# EasyEDA Pro project SCH_and_PCB.epro, board PCB5
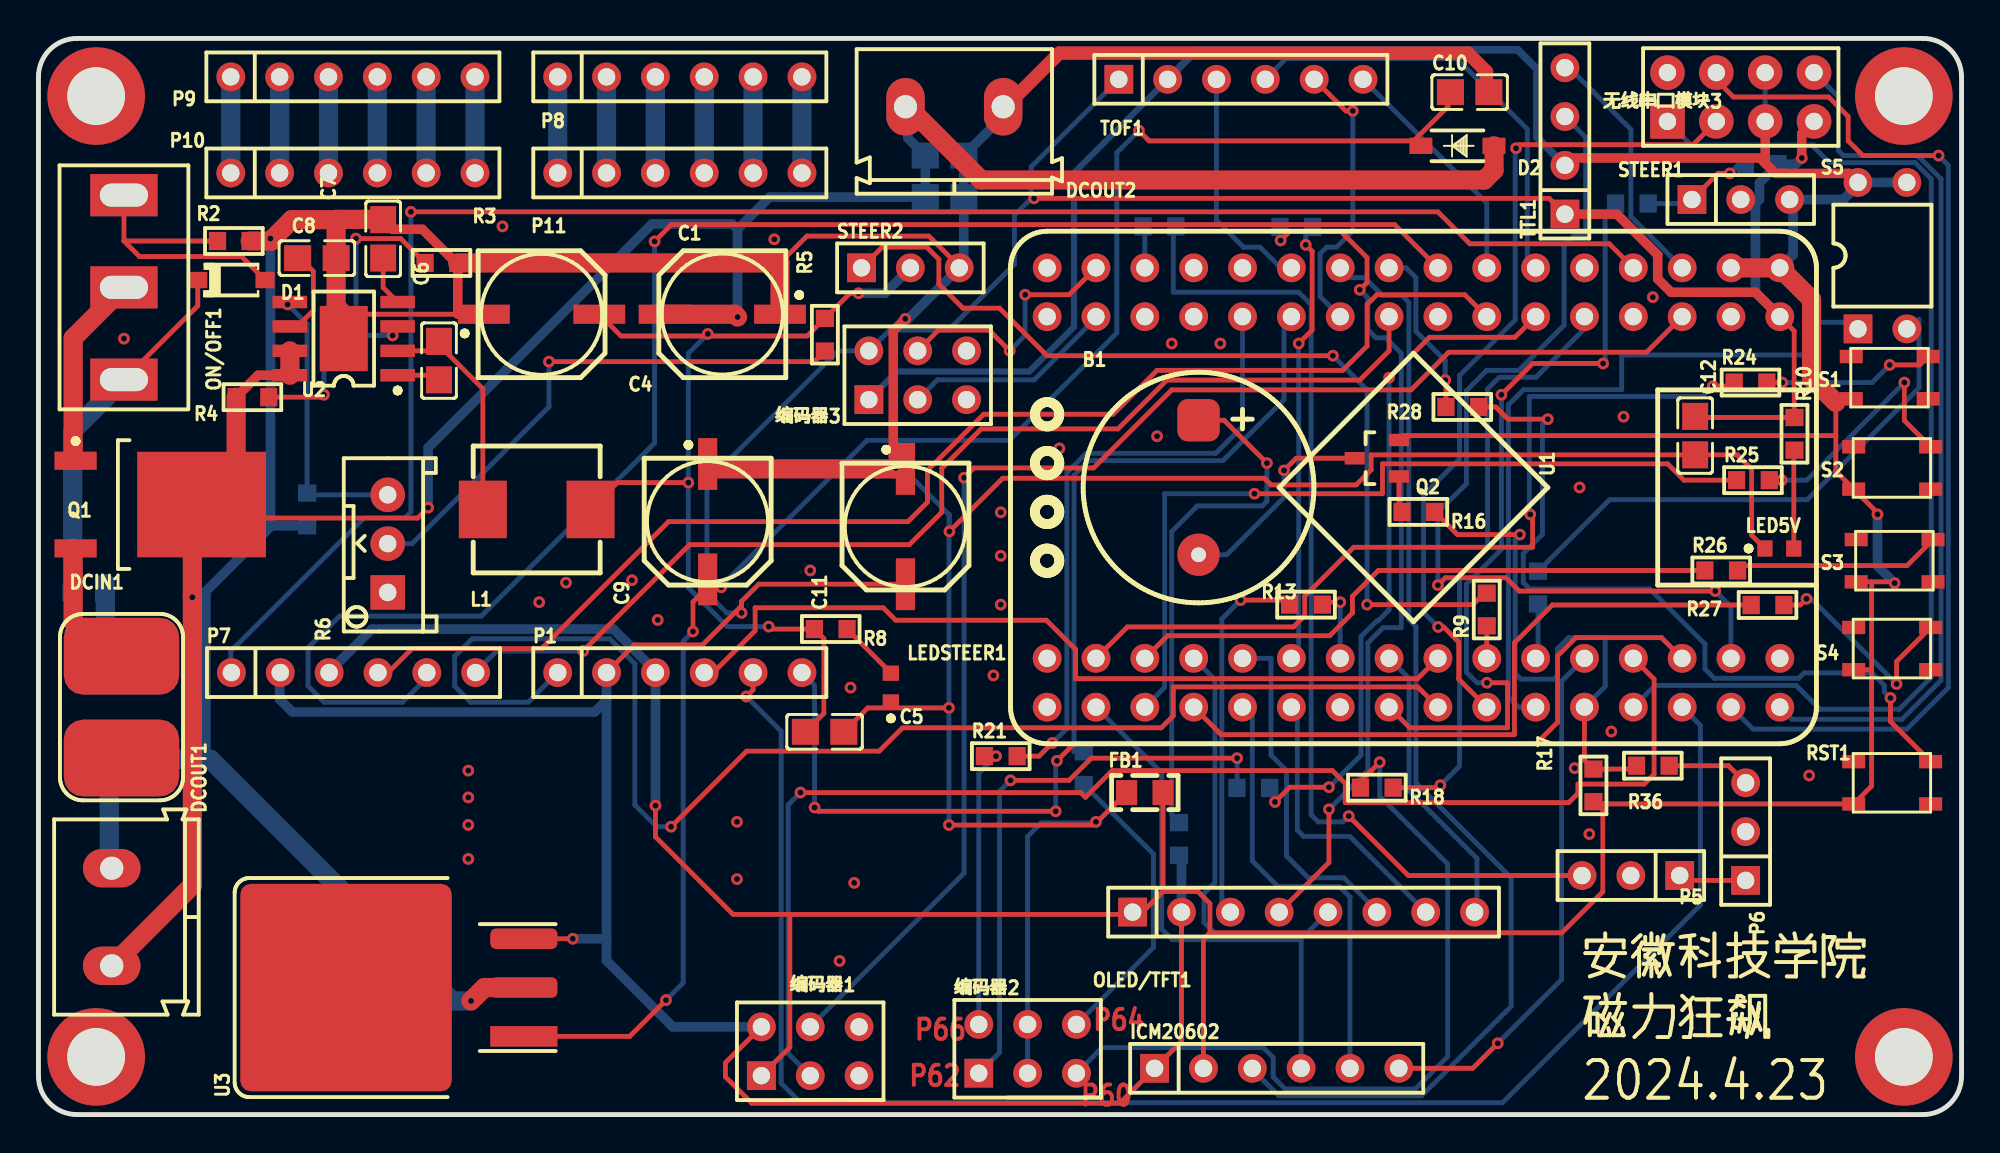
[diagram p8: board, top side]
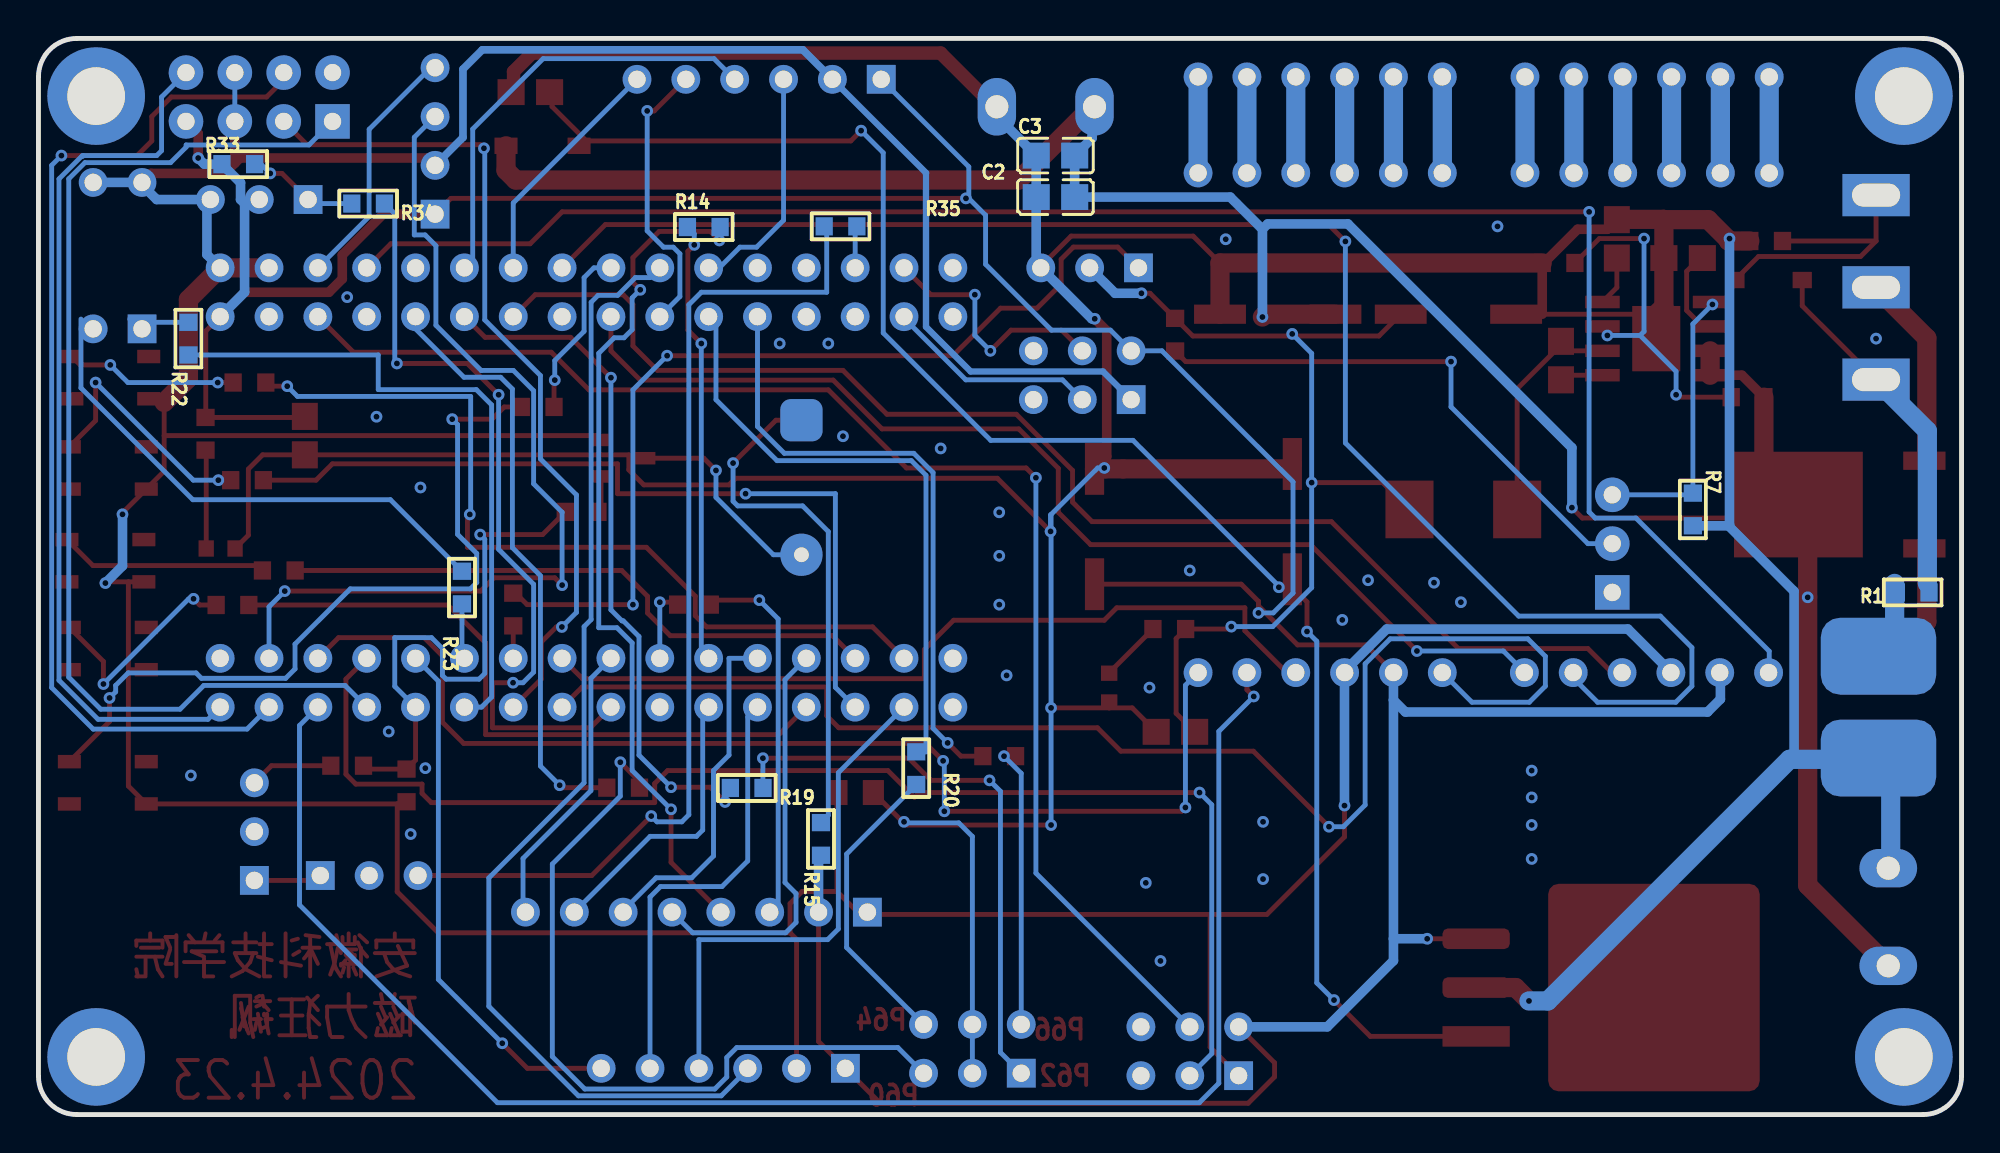
[diagram p9: board, bottom side, seen from below]

Outline 100 x 56 mm; copper layers: Top Layer, Bottom Layer. Coordinates in mm from the lower left corner of the outline.
Outline path: 0,54 0,2 arc(0.59,0.59) 2,0 98,0 arc(99.41,0.59) 100,2 100,54 arc(99.41,55.41) 98,56 2,56 arc(0.59,55.41) 0,54
Stack: Top Layer 0.035mm / Dielectric1 1.51mm FR4 er 4.5 / Bottom Layer 0.035mm

## Design rules (mm)
template: JLCPCB Capability(Two Layers Board)
spacing copperThickness1oz (default): track to track 0.102, other pairs 0.152 to 0.3
spacing copperThickness2oz: track to track 0.203, other pairs 0.152 to 0.3
track width copperThickness1oz (default): min 0.127, default 0.254, max 2.54
track width copperThickness2oz: min 0.203, default 0.254, max 2.54
differential pair differentialPair (default): width min 0.127, default 0.254, max 2.54; gap min 0.152, default 0.152
via viaSize (default): diameter min 0.5, default 0.61, max 10; hole min 0.3, default 0.305, max 6.3

## Placement (name value [footprint] x y rotation side)
B1  BEEP  [蜂鸣器-直插-无源蜂鸣器]  60.32 32.63 0 top
C1  100uF  [CAPS6.3]  35.56 41.65 0 top
C2  10uF  [C0805]  47.12 47.75 180 bottom
C3  100nF  [C0805]  47.12 49.9 180 bottom
C4  220uF  [CAPS6.3]  26.16 41.65 180 top
C5  100nF  [C0805]  40.88 19.92 180 top
C6  100nF  [C0805]  20.83 39.24 270 top
C7  100nF  [C0805]  17.92 45.57 270 top
C8  1uF  [C0805]  14.48 44.57 0 top
C9  100uF  [CAPS6.3]  34.8 30.85 90 top
C10  100nF  [C0805]  74.42 53.21 0 top
C11  220uF  [CAPS6.3]  45.09 30.6 90 top
C12  100nF  [C0805]  86.15 35.33 270 top
D1  BZT52C16  [SOD-123-L]  10.03 43.43 180 top
D2  SS54  [SOD-123]  73.79 50.41 180 top
DCIN1  T型插头  [WIRED T-HEADER THROUGHHOLE]  4.32 21.2 0 top
DCOUT1  DCOUT1  [KF/WJ/DG 301-2P-5.0MM]  3.81 10.28 270 top
DCOUT2  DCOUT2  [KF/WJ/DG 301-2P-5.0MM]  47.62 52.44 180 top
FB1  0R  [INDC2012[0805]S]  57.53 16.76 0 top
ICM20602  Header 6  [HDR1X6]  58.04 2.41 0 top
L1  3.3uH  [0630 TPC 7*7*3]  25.91 31.49 180 top
LED5V  GREEN  [LEDC1608(0603)]  90.53 29.46 0 top
LEDSTEER1  GREEN  [LEDC1608(0603)]  44.32 22.22 90 top
NOREF  -  [Pad_e85]  3 53 0 top
NOREF#2  -  [Pad_e86]  97 53 0 top
NOREF#3  -  [Pad_e84]  3 3 0 top
NOREF#4  -  [Pad_e87]  97 3 0 top
OLED/TFT1  Header 8  [HDR1X8]  56.9 10.53 0 top
ON/OFF1  SW-SPDT  [SS12D10]  4.44 43.05 90 top
P1  Header-D-M 1x6P  [HDR1X6-M]  27 23 0 top
P5  pwm1  [HDR1X3]  85.34 12.44 180 top
P6  pwm2  [HDR1X3]  88.77 12.19 90 top
P7  Header-D-M 1x6P  [HDR1X6-M]  10.03 23 0 top
P8  Header-D-M 1x6P  [HDR1X6-M]  27 54 0 top
P9  Header-D-M 1x6P  [HDR1X6-M]  10 54 0 top
P10  Header-D-M 1x6P  [HDR1X6-M]  10 49 0 top
P11  Header-D-M 1x6P  [HDR1X6-M]  27 49 0 top
Q1  HY19P03  [TO-252AA]  5.21 31.74 0 top
Q2  S8050  [SOT-23]  69.6 34.16 180 top
R1  4.7K  [RESC1608[0603]S-N]  2.54 27.17 180 bottom
R2  1K  [RESC1608[0603]S-N]  10.16 45.46 180 top
R3  10K  [RESC1608[0603]S-N]  20.95 44.32 180 top
R4  10K  [RESC1608[0603]S-N]  11.13 37.33 0 top
R5  100K  [RESC1608[0603]S-N]  40.89 40.58 270 top
R6  100K  [RESPOT3296]  18.16 27.17 90 top
R7  15K  [RESC1608[0603]S-N]  13.97 31.49 90 bottom
R8  10K  [RESC1608[0603]S-N]  41.2 25.27 180 top
R9  1K  [RESC1608[0603]S-N]  75.31 26.28 90 top
R10  4.7K  [RESC1608[0603]S-N]  91.31 35.43 270 top
R13  100R  [RESC1608[0603]S-N]  65.91 26.54 180 top
R14  100R  [RESC1608[0603]S-N]  65.4 46.19 180 bottom
R15  10R  [RESC1608[0603]S-N]  59.31 14.34 90 bottom
R16  4.7K  [RESC1608[0603]S-N]  71.75 31.36 180 top
R17  10K  [RESC1608[0603]S-N]  80.86 17.13 270 top
R18  100R  [RESC1608[0603]S-N]  69.6 17.01 180 top
R19  100R  [RESC1608[0603]S-N]  63.17 17 0 bottom
R20  100R  [RESC1608[0603]S-N]  54.36 18.03 270 bottom
R21  100R  [RESC1608[0603]S-N]  50.04 18.65 0 top
R22  470R  [RESC1608[0603]S-N]  92.2 40.38 90 bottom
R23  470R  [RESC1608[0603]S-N]  77.98 27.42 90 bottom
R24  470R  [RESC1608[0603]S-N]  89.03 38.09 0 top
R25  470R  [RESC1608[0603]S-N]  89.15 33.01 0 top
R26  470R  [RESC1608[0603]S-N]  87.5 28.31 0 top
R27  470R  [RESC1608[0603]S-N]  89.91 26.52 0 top
R28  470R  [RESC1608[0603]S-N]  74.04 36.82 0 top
R33  10K  [RESC1608[0603]S-N]  89.61 49.46 0 bottom
R34  100R  [RESC1608[0603]S-N]  82.86 47.41 0 bottom
R35  100R  [RESC1608[0603]S-N]  58.29 46.22 0 bottom
R36  100R  [RESC1608[0603]S-N]  83.95 18.15 0 top
RST1  Button  [PTS810-3*4-CURVEPIN]  96.39 17.27 0 top
S1  Button  [PTS810-3*4-CURVEPIN]  96.27 38.35 0 top
S2  Button  [PTS810-3*4-CURVEPIN]  96.39 33.65 0 top
S3  Button  [PTS810-3*4-CURVEPIN]  96.52 28.82 0 top
S4  Button  [PTS810-3*4-CURVEPIN]  96.39 24.25 0 top
S5  SW DIP-2  [DIP4]  95.88 44.7 0 top
STEER1  holl  [HDR1X3#2]  85.98 47.62 0 top
STEER2  Header 3  [HDR1X3#3]  42.8 44.06 0 top
TOF1  Header 6  [HDR1X6]  56.18 53.87 0 top
TTL1  Header 4  [HDR1X4]  79.38 46.86 90 top
U1  STC16F40K128_CoreBoard  [STC16F40K128_COREBOARD]  71.5 32.63 270 top
U2  SY8205FCC  [SOP-8E]  15.88 40.38 180 top
U3  SPX2940-5.0  [TO-263-3]  20.62 6.61 90 top
无线串口模块3  Header 4X2  [HDR4X2_A1]  84.71 51.68 0 top
编码器1  Header 3X2  [HDR2X3]  37.59 2.03 0 top
编码器2  电机信号  [HDR2X3]  48.9 2.15 0 top
编码器3  Header 3X2  [HDR2X3]  43.18 37.2 0 top

## Footprints (pads in the part's own frame, mm; a bottom-side part is the same pattern mirrored in y, then rotated)
0630 TPC 7*7*3
  rect 2.5x3 smd: 1(-2.8,0) 2(2.8,0)
C0805
  rect 1.41x1.35 smd: 1(-1,0) 2(1,0)
CAPS6.3
  rect 2.7x1 smd: 1(-3,0) 2(3,0)
DIP4
  rect 1.5x1.5 hole 0.9x0.905: 1(-1.27,-3.81)
  round 1.5 hole 0.9x0.905: 2(1.27,-3.81) 3(1.27,3.81) 4(-1.27,3.81)
HDR1X3
  rect 1.5x1.5 hole 0.905x0.9: 1(0,0)
  round 1.5 hole 0.9: 2(2.54,0)
  round 1.5 hole 0.905x0.9: 3(5.08,0)
HDR1X3#2
  rect 1.5x1.5 hole 0.905x0.9: 1(0,0)
  round 1.5 hole 0.905x0.9: 2(2.54,0) 3(5.08,0)
HDR1X3#3
  rect 1.5x1.5 hole 0.9: 1(0,0)
  round 1.5 hole 0.9: 2(2.54,0) 3(5.08,0)
HDR1X4
  rect 1.5x1.5 hole 0.905x0.9: 1(0,0)
  round 1.5 hole 0.905x0.9: 2(2.54,0) 3(5.08,0) 4(7.62,0)
HDR1X6
  rect 1.5x1.5 hole 0.905x0.9: 1(0,0)
  round 1.5 hole 0.905x0.9: 2(2.54,0) 3(5.08,0) 4(7.62,0) 5(10.16,0) 6(12.7,0)
HDR1X6-M
  round 1.5 hole 0.905x0.9: 1(0,0) 2(2.54,0) 3(5.08,0) 4(7.62,0) 5(10.16,0) 6(12.7,0)
HDR1X8
  rect 1.5x1.5 hole 0.905x0.9: 1(0,0)
  round 1.5 hole 0.905x0.9: 2(2.54,0) 3(5.08,0) 4(7.62,0) 5(10.16,0) 6(12.7,0) 7(15.24,0) 8(17.78,0)
HDR2X3
  rect 1.5x1.5 hole 0.9: 1(0,0)
  round 1.5 hole 0.9: 2(0,2.54) 3(2.54,0) 4(2.54,2.54) 5(5.08,0) 6(5.08,2.54)
HDR4X2_A1
  rect 1.8x1.8 hole 0.9: 1(0,0)
  round 1.8 hole 0.9: 2(0,2.54) 3(2.54,0) 4(2.54,2.54) 5(5.08,0) 6(5.08,2.54) 7(7.62,0)
  round 1.8 hole 0.905x0.9: 8(7.62,2.54)
INDC2012[0805]S
  rect 1.1x1.3 smd: 1(-0.948,0) 2(0.948,0)
KF/WJ/DG 301-2P-5.0MM
  oval 2x3 hole 1.2x1.205: 1(2.54,0) 2(-2.54,0)
LEDC1608(0603)
  rect 0.8x0.85 smd: A(0.75,0) C(-0.75,0)
Pad_e84
  round 5.08 hole 3: 1(0,0)
Pad_e85
  round 5.08 hole 3: 1(0,0)
Pad_e86
  round 5.08 hole 3: 1(0,0)
Pad_e87
  round 5.08 hole 3: 1(0,0)
PTS810-3*4-CURVEPIN
  rect 1.2x0.7 smd: 1(-2,-1.1) 2(2,1.1) 3(2,-1.1) 4(-2,1.1)
RESC1608[0603]S-N
  rect 0.9x0.95 smd: 1(-0.85,0) 2(0.85,0)
RESPOT3296
  rect 1.8x1.8 hole 0.905x0.9: 1(0,0)
  round 1.8 hole 0.9: 2(5.08,0) ADJ(2.54,0)
SOD-123
  rect 1.2x0.85 smd: A(-1.9,0) K(1.9,0)
SOD-123-L
  rect 1x0.85 smd: A(-1.75,0) K(1.75,0)
SOP-8E
  rect 2.5x3.4 smd: 0(0,0)
  rect 1.8x0.65 smd: 1(-2.8,1.905) 2(-2.8,0.635) 3(-2.8,-0.635) 4(-2.8,-1.905) 5(2.8,-1.905) 6(2.8,-0.635) 7(2.8,0.635) 8(2.8,1.905)
SOT-23
  rect 1.05x0.65 smd: 1(-1.15,0.95) 2(-1.15,-0.95) 3(1.15,0)
SS12D10
  rect 2.2x3.5 hole 1.2x2.5: 1(-4.8,0) 2(0,0) 3(4.8,0)
STC16F40K128_COREBOARD
  round 1.5 hole 0.9: 1(-11.43,19.05) 2(-8.89,19.05) 3(-11.43,16.51) 5(-11.43,13.97) 6(-8.89,13.97) 8(-8.89,11.43) 10(-8.89,8.89) 12(-8.89,6.35) 17(-11.43,-1.27) 19(-11.43,-3.81) 22(-8.89,-6.35) 24(-8.89,-8.89) 27(-11.43,-13.97) 29(-11.43,-16.51) 30(-8.89,-16.51) 35(8.89,-16.51) 36(11.43,-16.51) 37(8.89,-13.97) 38(11.43,-13.97) 39(8.89,-11.43) 40(11.43,-11.43) 41(8.89,-8.89) 42(11.43,-8.89) 43(8.89,-6.35) 44(11.43,-6.35) 45(8.89,-3.81) 47(8.89,-1.27) 48(11.43,-1.27) 49(8.89,1.27) 50(11.43,1.27) 51(8.89,3.81) 52(11.43,3.81) 53(8.89,6.35) 54(11.43,6.35) 55(8.89,8.89) 56(11.43,8.89) 57(8.89,11.43) 58(11.43,11.43) 59(8.89,13.97) 60(11.43,13.97) 61(8.89,16.51) 62(11.43,16.51)
  round 1.5 hole 0.905x0.9: 4(-8.89,16.51) 7(-11.43,11.43) 9(-11.43,8.89) 11(-11.43,6.35) 13(-11.43,3.81) 14(-8.89,3.81) 15(-11.43,1.27) 16(-8.89,1.27) 18(-8.89,-1.27) 20(-8.89,-3.81) 21(-11.43,-6.35) 23(-11.43,-8.89) 25(-11.43,-11.43) 26(-8.89,-11.43) 28(-8.89,-13.97) 31(-11.43,-19.05) 32(-8.89,-19.05) 33(8.89,-19.05) 34(11.43,-19.05) 46(11.43,-3.81) 63(8.89,19.05) 64(11.43,19.05)
TO-252AA
  rect 6.7x5.5 smd: 1(3.275,0)
  rect 2.2x0.95 smd: 2(-3.275,2.28) 3(-3.275,-2.28)
TO-263-3
  rect 1.07x3.5 smd: 1(-2.54,-4.623)
  custom 1.07x3.5 smd: 2(0,-4.623) 3(2.54,-4.623)
  custom 10.8x11 smd: 4(0,4.623)
WIRED T-HEADER THROUGHHOLE
  custom 6x4 hole 2.605x2.6: 1(0,2.65) 2(0,-2.65)
蜂鸣器-直插-无源蜂鸣器
  custom 2.2x2.2 hole 0.767x0.762: 1(0,3.5)
  round 2.2 hole 0.767x0.762: 2(0,-3.5)

## Nets
GND_5V: FB1.2 ICM20602.2 OLED/TFT1.1 P1.3 P7.3 Q2.2 R17.2 RST1.1 S1.1 S2.1 S3.1 S4.1 S5.3 S5.4 STEER1.3 TOF1.2 TTL1.2 U1.1 U1.3 无线串口模块3.5 无线串口模块3.6 编码器1.1 编码器3.1
GND_BAT: C1.2 C2.1 C3.1 C4.2 C5.1 C7.1 C8.2 C9.2 C10.2 C11.2 C12.2 DCIN1.2 DCOUT1.2 DCOUT2.2 FB1.1 LED5V.C LEDSTEER1.C R2.1 R3.1 R7.1 STEER2.3 U2.0 U3.2 编码器2.3 编码器2.4
GNDBAT: NOREF.1 NOREF#2.1 NOREF#3.1 NOREF#4.1 P5.1 P6.1
VCC_5V: C11.1 C12.1 ICM20602.1 OLED/TFT1.2 P1.2 P7.2 R10.1 R15.1 R33.2 STEER1.2 TOF1.1 TTL1.1 U1.2 U3.3 无线串口模块3.7 编码器1.2 编码器3.2
VCC_BAT: C1.1 C2.2 C3.2 D2.A DCOUT1.1 DCOUT2.1 Q1.1 R4.1 U2.7 U2.8
VCC_STEER: C4.1 C5.2 L1.1 R5.1 R8.2 STEER2.2
0.0: P1.1 U1.50
0.1: P1.4 U1.49
0.2: U1.52 无线串口模块3.3
0.3: U1.58 无线串口模块3.1
0.4: U1.57 编码器1.3
0.5: P1.5 U1.60
0.6: P1.6 U1.59
0.7: U1.62 无线串口模块3.4
1.0: TTL1.3 U1.61
1.1: TTL1.4 U1.5
1.3: P7.1 U1.7
1.4: P7.4 U1.14
1.6: P7.5 U1.15
1.7: P7.6 U1.18
2.0: OLED/TFT1.5 U1.39
2.1: OLED/TFT1.6 U1.41
2.2: OLED/TFT1.7 U1.44
2.3: R14.1 U1.43
2.5: R13.1 U1.45
2.6: R34.1 U1.48
2.7: OLED/TFT1.8 U1.47
3.3: R35.1 U1.27
3.4: U1.30 编码器3.3
3.5: U1.29 编码器3.4
4.0: ICM20602.3 U1.19
4.1: ICM20602.4 U1.36
4.2: ICM20602.5 U1.42
4.3: ICM20602.6 U1.55
4.4: TOF1.6 U1.13
4.5: U1.64 无线串口模块3.8
4.7: TOF1.5 U1.20
5.3: U1.6 编码器1.4
6.0: R18.1 U1.10
6.2: R19.2 U1.12
6.3: TOF1.4 U1.11
6.4: R20.1 U1.22
6.5: TOF1.3 U1.21
6.6: R21.2 U1.24
7.0: R24.1 U1.35
7.1: R25.1 U1.38
7.2: R26.1 U1.37
7.3: R27.1 U1.40
7.4: R9.1 U1.51
7.5: R22.1 U1.54
7.6: R23.1 U1.53
7.7: R16.1 R17.1 R36.1 U1.56
FB: R6.2 R7.2 U2.5
RST: R28.1 U1.17
$1N608: LEDSTEER1.A R8.1
$1N619: R5.2 R6.ADJ
$1N620: C6.1 L1.2 U2.2
$1N623: C7.2 U2.4
$1N624: R3.2 R4.2 U2.3
$1N625: C6.2 U2.1
$1N644: C8.1 U2.6
$1N667: R9.2 STEER2.1
$1N828: C9.1 C10.1 D2.K U3.1
$1N831: LED5V.A R10.2
$1N927: OLED/TFT1.3 R13.2
$1N930: OLED/TFT1.4 R14.2
$1N1033: B1.2 Q2.3
$1N1034: B1.1 R15.2
$1N1043: Q2.1 R16.2
$1N1188: R20.2 编码器2.6
$1N1189: R21.1 编码器2.2
$1N1190: R18.2 编码器2.5
$1N1191: R19.1 编码器2.1
$1N1401: DCIN1.1 Q1.3 R1.1
$1N1404: D1.K ON/OFF1.1 R1.2
$1N1405: D1.A ON/OFF1.3 R2.2
$1N1408: ON/OFF1.2 Q1.2
$1N1512: P5.3 R35.2
$1N1513: P6.3 R36.2
$1N1603: R33.1 R34.2 STEER1.1
$1N1624: R22.2 S5.1
$1N1625: R23.2 S5.2
$1N1628: R24.2 S1.2
$1N1629: R25.2 S2.2
$1N1630: R26.2 S3.2
$1N1631: R27.2 S4.2
$1N1632: R28.2 RST1.2
$1N8370: P9.1 P10.1
$1N8373: P9.2 P10.2
$1N8376: P9.3 P10.3
$1N8379: P9.4 P10.4
$1N8382: P9.5 P10.5
$1N8385: P9.6 P10.6
$1N8391: P8.1 P11.1
$1N8394: P8.2 P11.2
$1N8397: P8.3 P11.3
$1N8400: P8.4 P11.4
$1N8403: P8.5 P11.5
$1N8406: P8.6 P11.6

Pads without a net: P5 2; P6 2; R6 1; RST1 3 4; S1 3 4; S2 3 4; S3 3 4; S4 3 4; U1 4 8 9 16 23 25 26 28 31 32 33 34 46 63; U3 4; 无线串口模块3 2; 编码器1 5 6; 编码器3 5 6

## Via types
v1: diameter 0.61, hole 0.305, Top Layer to Bottom Layer, 120 vias

## Routing (per net, layer and track width the routed paths; a pad name or vN(x,y) marks a point on that pad's centre or on a via; arc(x,y) is an arc through that point)
GND_5V: length 265.1
  Top Layer w0.254: 58.48,11.61 60.29,11.61 60.92,10.98 60.92,9.46 ; 58.48,11.61 57.4,10.53 OLED/TFT1.1 56.78,10.42 39.07,10.42 ; 58.48,11.61 FB1.2 ; 95.32,27.72 95.32,23.15 ; 95.32,27.72 96.46,27.72 v1(96.52,27.66) ; 95.32,27.72 S3.1 ; 95.32,23.15 S4.1 ; 95.32,23.15 95.32,17.1 RST1.1 81.34,16.17 ; v1(95.63,31.23) 95.63,31.31 S2.1 93.46,33.48 93.46,35.33 ; 81.34,16.17 80.97,16.17 R17.2 ; 81.34,16.17 81.34,11.59 79.21,9.46 60.92,9.46 ; 60.92,9.46 60.58,9.12 60.58,2.41 ; 93.46,35.33 70.97,35.33 Q2.2 ; 93.46,35.33 93.46,37.06 93.65,37.25 S1.1 ; 39.07,10.42 39.07,3.51 编码器1.1 ; 39.07,10.42 36.12,10.42 32.09,14.45 v1(32.09,16.08)
  Top Layer w0.5: 94.62,48.51 94.15,48.98 90.32,48.98 89.79,49.51 ; 89.79,51.68 89.79,49.51 ; 89.79,49.51 89.52,49.78 79.76,49.78 TTL1.2
  Top Layer w1: 93.46,37.06 92.2,38.32 92.2,42.41 U1.1 U1.3
  Bottom Layer w0.254: 91.24,47.62 STEER1.3 ; 89.79,54.22 89.79,51.68
  Bottom Layer w0.33: TOF1.2 53.85,49 53.85,40.99 51.53,38.67 44.64,38.67 编码器3.1
  Bottom Layer w0.4: TOF1.2 60.25,55.41 76.92,55.41 77.93,54.4 77.93,50.85 TTL1.2
  Bottom Layer w0.5: 15.08,23 17.35,25.27 29.89,25.27 32.08,23.07 P1.3 32.09,22.99 v1(32.09,16.08) ; U1.1 91.24,44.75 91.24,47.62 93.85,47.62 94.74,48.51 97.28,48.51 ; v1(96.52,27.66) 95.63,28.55 v1(95.63,31.23)
GND_BAT: length 284.4
  Top Layer w0.254: 44.32,21.16 43.12,21.16 C5.1 ; 44.32,21.16 LEDSTEER1.C ; 44.32,21.16 v1(47.34,21.16) ; U2.0 15.88,41.65 C4.2 ; FB1.1 55.06,15.23 v1(54.99,15.23) 54.82,15.07 v1(47.34,15.07) ; STEER2.3 47.88,44.14 46.3,45.71 39.96,45.71 38.56,44.32 ; LED5V.C 89.09,30.15 89.09,33.59 88.34,34.33 C12.2 69.3,34.33 69.3,33.55 68.52,32.77 64.1,32.77 63.75,33.11 50.14,33.11 v1(47.37,30.35) ; 43.6,33.6 43.65,33.65 v1(44.58,33.65) 44.53,33.6 ; 12.12,45.46 12.06,45.51 v1(12.06,45.59)
  Top Layer w0.5: v1(45.07,41.41) 44.45,40.79 44.45,34.23 C11.2 ; 21.81,41.65 21.81,44.23 19.96,46.07 18.42,46.07 C7.1
  Top Layer w0.7: C10.2 75.29,53.33 75.29,54.27 74.33,55.24 53.09,55.24 50.29,52.44
  Top Layer w1: R2.1 12.12,45.46 12.12,45.51 13.18,46.57 15.48,46.57 ; 15.48,46.57 15.49,46.59 17.94,46.59 C7.1 ; 15.48,46.57 C8.2 15.48,42.05 15.88,41.65 ; R3.1 38.56,44.32 C1.2 ; 25.24,6.61 23.19,6.61 v1(22.49,5.91) ; C11.2 35.05,33.6 C9.2
  Bottom Layer w0.254: 47.34,31.22 47.37,31.2 v1(47.37,30.35) ; 47.34,31.22 44.92,33.65 v1(44.58,33.65) ; 47.34,31.22 v1(47.34,21.16) v1(47.34,15.07) ; v1(54.99,15.23) 54.94,15.18 52.14,15.18 51.44,14.47 编码器2.4 编码器2.3 ; 3.68,18.49 3.67,18.49
  Bottom Layer w0.5: 12.12,30.64 12.06,30.69 v1(12.06,45.59) ; 12.12,30.64 R7.1 ; 12.12,30.64 8.71,27.23 8.71,18.72 8.94,18.49 ; 50.29,52.44 50.29,52.08 C3.1 C2.1 48.12,44.3 STEER2.3 45.23,41.41 v1(45.07,41.41)
  Bottom Layer w1: v1(22.49,5.91) 21.51,5.91 8.94,18.49 3.68,18.49 3.68,13.2
GNDBAT: length 3.5
  Top Layer w0.254: P6.1 85.6,12.19 P5.1
  vias: v1(4.44,40.38) v1(22.35,17.9) v1(22.35,16.5) v1(22.35,15.07) v1(22.35,13.3) v1(24.13,46.22) v1(26.03,26.66) v1(27.43,27.68) v1(30.86,27.81) v1(32.2,25.74) v1(36.32,15.23) v1(36.32,12.25) v1(38.26,45.55) v1(40.13,28.31) v1(41.66,7.99) v1(42.23,22.22) v1(42.42,12.06) v1(49.66,22.85) v1(50.04,31.34) v1(50.04,29.08) v1(50.04,26.54) v1(53.09,34.66) v1(58.17,35.3) v1(58.93,40.12) v1(61.46,40.12) v1(79.88,18.03) v1(80.14,32.63) v1(80.65,14.6) v1(81.79,19.93) v1(82.42,36.31) v1(83.95,42.54) v1(92.07,17.65)
VCC_5V: length 211.6
  Top Layer w0.254: 36.56,26.7 36.56,26.47 34.53,24.44 30.98,24.44 P1.2 ; 36.56,26.7 37.46,27.6 C11.1 ; 36.56,26.7 36.56,26.7 v1(36.56,26.11) ; 编码器1.2 35.72,2.7 35.72,1.96 37.1,0.59 56.22,0.59 ICM20602.1 59.44,3.8 OLED/TFT1.2 ; 91.3,36.28 86.2,36.28 C12.1 ; 91.3,36.28 R10.1 ; 91.3,36.28 91.3,40.77 U1.2 ; v1(27.79,9.15) 25.24,9.15 ; TTL1.1 78.55,47.68 v1(51.77,47.68)
  Top Layer w0.5: TTL1.1 82.08,46.86 84.2,44.73 84.2,43.49 84.9,42.79 89.28,42.79 U1.2 ; v1(91.69,49.78) 91.69,51.05 无线串口模块3.7
  Bottom Layer w0.254: 51.62,47.68 51.62,49.32 TOF1.1 ; 51.62,47.68 v1(51.77,47.68) ; 51.62,47.68 50.75,46.8 50.75,44.25 47.32,40.82 44.26,40.82 编码器3.2 41.58,39.74 34.76,32.92 34.76,27.14 35.79,26.11 v1(36.56,26.11) ; 89.49,47.62 STEER1.2
  Bottom Layer w0.5: 29.54,21.57 29.54,9.15 ; 29.54,21.57 P1.2 ; 29.54,21.57 28.92,20.95 13.21,20.95 12.54,21.62 12.54,23 ; 29.54,9.15 29.54,8.01 32.98,4.56 编码器1.2 ; 29.54,9.15 v1(27.79,9.15) ; R15.1 59.44,13.37 OLED/TFT1.2 ; U1.2 89.28,42.79 89.28,47.41 89.49,47.62 89.49,48.49 R33.2 91.38,49.46 v1(91.69,49.78)
VCC_BAT: length 130.1
  Top Layer w0.254: v1(20.26,31.58) 19.72,31.04 10.98,31.04 10.28,31.74
  Top Layer w0.5: U2.8 11.42,38.47 10.28,37.33
  Top Layer w1: v1(36.35,41.5) 36.21,41.65 C1.1 ; 45.21,52.44 49.02,48.63 75.18,48.63 75.69,49.14 D2.A ; 10.28,37.33 10.28,31.74 8.36,31.74 8,31.39 v1(8,26.92) 8,11.93 DCOUT1.1 ; U2.7 U2.8
  Bottom Layer w0.5: 36.35,46.07 v1(36.35,41.5) ; 36.35,46.07 38.03,47.75 C2.2 C3.2 45.21,50.81 45.21,52.44 ; 36.35,46.07 36.08,46.35 31.91,46.35 20.26,34.7 v1(20.26,31.58)
VCC_STEER: length 50.9
  Top Layer w0.254: C4.1 30.3,40.52 34.81,40.52 ; v1(33.79,32.89) 30.11,32.89 L1.1 ; v1(42.65,42.74) 42.2,42.74 R5.1 39.97,40.52 34.81,40.52 ; v1(34.81,40.62) 34.81,40.52 ; v1(37.97,25.39) 38.1,25.27 R8.2 40.84,24.77 40.84,20.88 C5.2
  Bottom Layer w0.254: v1(37.97,25.39) 35.82,25.39 33.79,27.42 v1(33.79,32.89) 33.79,39.61 v1(34.81,40.62)
  Bottom Layer w0.5: v1(42.65,42.74) 44.02,42.74 STEER2.2
0.0: length 72.1
  Top Layer w0.254: U1.50 71.72,22.25 59.01,22.25 59.01,20.76 58.38,20.13 44.93,20.13 43.72,18.91 36.82,18.91 v1(32.89,14.98)
  Bottom Layer w0.254: P1.1 25.46,21.46 22.48,21.46 21.64,22.29 21.64,23.85 22.55,24.76 29.71,24.76 31.01,23.45 31.01,16.11 32.14,14.98 v1(32.89,14.98)
0.1: length 43.1
  Top Layer w0.254: P1.4 35.09,23 37.27,25.18 37.27,26.37 43.93,26.37 44.58,25.72 52.41,25.72 53.93,24.2 53.93,22.68 71.71,22.68 U1.49
0.2: length 43.6
  Top Layer w0.254: v1(76.84,50.28) 77.02,50.47 86.04,50.47 无线串口模块3.3 ; v1(72.78,25.37) 73.07,25.37 73.85,24.59 73.85,22.66 U1.52
  Bottom Layer w0.254: v1(76.84,50.28) 76.79,50.24 76.79,41.35 73.9,38.46 73.9,34.12 72.02,32.25 72.02,26.13 v1(72.78,25.37)
0.3: length 58.1
  Bottom Layer w0.254: U1.58 84.06,22.33 91.4,22.33 92.64,21.09 96.76,21.09 98.43,22.76 98.43,48.69 97.58,49.54 93.13,49.54 92.32,50.35 92.32,50.46 85.93,50.46 无线串口模块3.1
0.4: length 69.2
  Top Layer w0.254: v1(39.62,16.76) 54.2,16.76 54.45,16.51 55.83,17.9 67.28,17.9 67.96,17.23 67.96,16.23 79.57,16.23 80.05,16.72 80.05,17.2 83.5,17.2 84.01,17.71 84.01,22.66 U1.57
  Bottom Layer w0.254: 编码器1.3 38.99,3.17 38.99,16.12 v1(39.62,16.76)
0.5: length 85.4
  Top Layer w0.254: v1(36.81,21.76) 37.16,22.11 P1.5
  Bottom Layer w0.254: U1.60 86.43,20.25 86.43,10.91 76.13,0.62 39.63,0.62 38.62,1.63 38.62,19.94 v1(36.81,21.76)
0.6: length 60.2
  Top Layer w0.254: v1(52.96,18.41) 53.86,19.31 77.89,19.31 78.99,20.42 78.99,23.87 79.94,24.82 84.4,24.82 U1.59 ; v1(52.9,15.78) 40.56,15.78 v1(40.36,15.98)
  Bottom Layer w0.254: v1(52.96,18.41) 52.9,18.34 v1(52.9,15.78) ; P1.6 40.36,22.34 v1(40.36,15.98)
0.7: length 54.9
  Top Layer w0.254: v1(98.81,49.9) 94.87,49.9 94.11,50.67 94.11,51.94 93.09,52.95 88.14,52.95 87.25,53.84 无线串口模块3.4
  Bottom Layer w0.254: v1(98.81,49.9) 99.31,49.4 99.31,22.22 97.16,20.06 89.15,20.06 U1.62
1.0: length 48
  Top Layer w0.254: v1(72.77,27.55) 73.15,27.93 76.31,27.93 77,27.24 v1(87.19,27.24)
  Bottom Layer w0.254: U1.61 88.01,26.42 v1(87.19,27.24) ; v1(72.77,27.55) 72.77,31.34 74.25,32.83 74.25,37.67 75.31,38.72 76.98,38.72 79.33,41.08 79.33,45.21 79.89,45.78 80.46,45.78 80.46,50.86 TTL1.3
1.1: length 13.1
  Bottom Layer w0.254: TTL1.4 79.6,54.48 82.8,51.27 82.8,46.73 U1.5
1.3: length 93.9
  Top Layer w0.254: v1(19.37,46.98) 72.77,46.98 74.43,45.32 81.68,45.32 U1.7
  Bottom Layer w0.254: v1(19.37,46.98) 19.37,31.36 19.05,31.04 16.93,31.04 10,24.11 10,23
1.4: length 68.5
  Top Layer w0.254: U1.14 74.17,42.67 69.6,42.67 69.09,42.16 69.09,40 67.82,38.73 58.17,38.73 55.88,36.44 49.15,36.44 46.23,33.52 46.23,31.87 45.21,30.85 32.77,30.85 26.16,24.25 19.43,24.25 18.18,23 P7.4
1.6: length 84.4
  Top Layer w0.254: 20.16,22.95 20.16,23 ; v1(32.04,45.44) 32.92,46.31 70.52,46.31 U1.15
  Bottom Layer w0.254: 20.47,23 18.92,21.46 14.86,21.46 14.02,22.29 14.02,24.3 15.66,25.94 23.03,25.94 32.04,34.95 v1(32.04,45.44)
1.7: length 57.6
  Top Layer w0.254: v1(28.32,24.12) 33.86,29.66 45.29,29.66 46.97,31.34 46.97,33.63 49.02,35.68 56.13,35.68 58.67,38.22 68.71,38.22 70.23,39.74 U1.18
  Bottom Layer w0.254: 22.7,23 23.82,24.12 v1(28.32,24.12)
2.0: length 21.6
  Bottom Layer w0.254: OLED/TFT1.5 65.98,9.46 61.15,9.46 60.61,10 60.61,11.5 61.18,12.07 61.18,22.63 U1.39
2.1: length 18.1
  Bottom Layer w0.254: U1.41 64.09,23.74 64.09,18.7 64.9,17.9 64.9,13.45 66.03,12.32 67.88,12.32 69.6,10.61 OLED/TFT1.6
2.2: length 15
  Bottom Layer w0.254: U1.44 65.46,20.89 65.46,14.8 65.79,14.48 68.19,14.48 OLED/TFT1.7
2.3: length 23.2
  Top Layer w0.254: v1(65.9,45.26) 66.23,44.92 66.23,40.83 v1(65.53,40.12)
  Bottom Layer w0.254: v1(65.9,45.26) 65.9,45.83 R14.1 ; v1(65.53,40.12) 65.53,24.12 U1.43
2.5: length 3.9
  Top Layer w0.254: v1(67.69,26.66) 66.89,26.66 R13.1
  Bottom Layer w0.254: v1(67.69,26.66) U1.45
2.6: length 41.1
  Top Layer w0.254: v1(81.36,39.09) 77.7,39.09 v1(76.07,37.46) ; U1.48 71.31,20.13 76.39,20.13 76.39,22.47 v1(75.32,22.47)
  Bottom Layer w0.254: v1(76.07,37.46) 76.07,29.42 74.25,27.6 74.25,23.02 74.8,22.47 v1(75.32,22.47) ; v1(81.36,39.09) 81.47,39.2 81.47,46.87 R34.1
2.7: length 15.2
  Bottom Layer w0.254: OLED/TFT1.8 74.8,10.66 74.8,13.33 71.27,16.86 71.27,22.7 U1.47
3.3: length 2
  Bottom Layer w0.254: U1.27 57.53,46.06 57.57,46.09
3.4: length 11.1
  Bottom Layer w0.254: U1.30 54.99,41.45 51.78,38.23 46.75,38.23 编码器3.3
3.5: length 13.2
  Top Layer w0.254: U1.29 53.59,42.67 v1(51.31,42.67) ; v1(50.5,39.74) 49.43,40.82 46.8,40.82 编码器3.4
  Bottom Layer w0.254: v1(50.5,39.74) 51.31,40.55 v1(51.31,42.67)
4.0: length 59.2
  Bottom Layer w0.254: ICM20602.3 63.12,2.35 64.5,0.97 71.92,0.97 76.58,5.63 76.58,12.31 71.63,17.27 71.63,25.39 71.26,25.76 71.26,42.27 70.9,42.63 69.88,42.63 68.96,43.55 68.2,43.55 U1.19
4.1: length 27.1
  Bottom Layer w0.254: ICM20602.4 65.66,9.1 58.96,9.1 58.41,9.66 58.41,17.79 U1.36
4.2: length 23
  Bottom Layer w0.254: U1.42 63.12,20.69 63.12,13.2 64.46,11.86 67.65,11.86 68.2,11.32 68.2,2.41
4.3: length 27.6
  Top Layer w0.254: v1(75.88,3.71) 74.58,2.41 70.74,2.41
  Bottom Layer w0.254: v1(75.88,3.71) 79.21,7.03 79.21,22.56 U1.55
4.4: length 12.5
  Bottom Layer w0.254: U1.13 75.31,47.44 TOF1.6
4.5: length 46.1
  Bottom Layer w0.254: 无线串口模块3.8 93.6,52.95 93.6,50.16 93.85,49.9 97.66,49.9 97.69,49.87 97.73,49.89 98.93,48.69 98.93,22.6 96.9,20.57 91.19,20.57 U1.64
4.7: length 14.8
  Top Layer w0.254: v1(68.35,52.23) 67.98,52.23 TOF1.5
  Bottom Layer w0.254: U1.20 66.65,42.57 66.65,44.79 66.99,45.14 67.5,45.14 68.35,45.99 v1(68.35,52.23)
5.3: length 72.7
  Top Layer w0.254: v1(48.13,33.14) 48.64,33.65 54.86,33.65 58.93,37.71 71.37,37.71 73.33,39.67 83.62,39.67 U1.6
  Bottom Layer w0.254: 编码器1.4 48.13,12.57 v1(48.13,33.14)
6.0: length 31.1
  Top Layer w0.254: v1(72.9,17.14) 72.77,17.01 R18.1
  Bottom Layer w0.254: U1.10 80.39,40.89 77.87,38.37 75.97,38.37 75.35,37.76 75.35,29.5 73.9,28.04 73.9,18.14 v1(72.9,17.14)
6.2: length 35.6
  Top Layer w0.254: v1(67.11,17.03) 65.07,17.03 v1(64.3,16.27) ; v1(70.23,38.35) 72.33,40.45 76.78,40.45 U1.12
  Bottom Layer w0.254: R19.2 64.3,16.72 v1(64.3,16.27) ; v1(67.11,17.03) 68.77,18.7 68.77,24.88 69.59,25.69 69.66,25.69 70.23,26.27 v1(70.23,38.35)
6.3: length 23
  Bottom Layer w0.254: U1.11 77.42,44.49 77.42,51.28 73.75,54.95 64.87,54.95 TOF1.4
6.4: length 31.9
  Bottom Layer w0.254: U1.22 64.77,41.14 64.77,37.2 61.59,34.03 54.61,34.03 53.85,33.27 53.85,18.88 R20.1
6.5: length 12.3
  Bottom Layer w0.254: U1.21 64.6,44.06 63.52,45.14 62.66,45.14 61.26,46.54 TOF1.3
6.6: length 32.3
  Top Layer w0.254: R21.2 52.03,18.65 v1(52.72,19.34)
  Bottom Layer w0.254: v1(52.72,19.34) 53.48,20.1 53.48,33.41 54.48,34.41 61.21,34.41 62.61,35.81 U1.24
7.0: length 44.7
  Top Layer w0.254: 88.3,38.09 88.12,37.9 v1(87.06,37.9) ; U1.35 56.63,25.38 65.26,25.38 65.84,25.96 65.84,26.97 68.39,29.52 77.69,29.52 77.69,31.11 v1(77.57,31.23) 77.57,31.23
  Bottom Layer w0.254: v1(77.57,31.23) 77.53,31.27 77.53,37.37 86.53,37.37 v1(87.06,37.9)
7.1: length 43.2
  Top Layer w0.254: v1(63.23,32.31) 69.89,32.31 69.89,33.86 84.72,33.86 85.57,33.01 R25.1
  Bottom Layer w0.254: U1.38 58.56,22.23 58.56,32.31 v1(63.23,32.31)
7.2: length 31.5
  Top Layer w0.254: R26.1 69.67,28.31 68.33,26.97 68.33,26.1 67.15,24.92 58.71,24.92 U1.37
7.3: length 35.2
  Top Layer w0.254: R27.1 78.72,26.52 76.75,24.54 76.75,19.77 61.5,19.77 U1.40
7.4: length 1.8
  Top Layer w0.254: U1.51 75.31,25.48 75.27,25.52
7.5: length 34.7
  Bottom Layer w0.254: U1.54 76.96,21.2 76.44,21.73 76.44,36.93 77.23,37.73 82.33,37.73 82.33,39.53 92.2,39.53
7.6: length 2.9
  Bottom Layer w0.254: U1.53 77.98,23.87 R23.1
7.7: length 28.5
  Top Layer w0.254: v1(77.03,30.18) 73.79,30.18 R16.1 ; U1.56 80.39,18.45 R17.1 82.92,17.98 R36.1
  Bottom Layer w0.254: v1(77.03,30.18) 76.79,29.94 76.79,22.95 77.09,22.66 78.8,22.66 78.99,22.85 78.99,24.25 79.56,24.82 81.47,24.82 81.47,22.28 U1.56
FB: length 14.6
  Top Layer w0.254: U2.5 13.08,42.28 v1(12.95,42.16)
  Bottom Layer w0.254: R6.2 14.06,32.25 R7.2 13.97,41.14 v1(12.95,42.16)
RST: length 9
  Top Layer w0.254: v1(73.15,38.22) 73.19,38.18 R28.1
  Bottom Layer w0.254: U1.17 71.12,44.06 71.63,43.55 71.63,40.76 73.15,39.24 v1(73.15,38.22)
$1N608: length 3.2
  Top Layer w0.254: LEDSTEER1.A 44.32,22.99 42.05,25.27
$1N619: length 28.3
  Top Layer w0.254: v1(26.55,39.18) 40.34,39.18 R5.2
  Bottom Layer w0.254: R6.ADJ 19.43,29.71 26.55,36.83 v1(26.55,39.18)
$1N620: length 12
  Top Layer w0.254: U2.2 20.83,39.74 ; 20.83,39.74 21.13,39.74 23.11,37.77 L1.2 ; 20.83,39.74 C6.1
$1N623: length 2.6
  Top Layer w0.254: C7.2 17.92,43.04 U2.4
$1N624: length 18.3
  Top Layer w0.254: R3.2 18.83,45.59 v1(16.51,45.59) ; R4.2 14.72,37.33 v1(14.84,37.46) ; v1(18.42,40.54) 18.42,40.76 U2.3
  Bottom Layer w0.254: 16.72,40.54 16.51,40.75 v1(16.51,45.59) ; 16.72,40.54 v1(18.42,40.54) ; 16.72,40.54 14.84,38.67 v1(14.84,37.46)
$1N625: length 2.3
  Top Layer w0.254: U2.1 20.59,38.47 C6.2
$1N644: length 4.8
  Top Layer w0.254: 13.48,44.7 14.29,43.88 14.29,41.84 13.46,41.01 U2.6
$1N667: length 48.2
  Top Layer w0.254: 75.27,27.22 74.59,26.54 v1(69.09,26.54) ; v1(67.31,39.49) 52.45,39.49 49.97,41.96 48.07,41.96 46.82,43.22 46.82,44.51 46.19,45.14 43.88,45.14 STEER2.1
  Bottom Layer w0.254: v1(67.31,39.49) 69.09,37.71 v1(69.09,26.54)
$1N828: length 86.6
  Top Layer w0.254: 25.24,4.07 30.74,4.07 v1(32.63,5.96) ; 34.8,27.44 v1(35.5,27.44) ; 34.8,27.44 C9.1 ; 34.8,27.44 34.04,26.68 v1(34.04,25.14) ; v1(57.22,51.2) 57.76,50.67 71.51,50.67 73.29,52.45 73.29,53.08 C10.1
  Bottom Layer w0.254: v1(35.5,27.44) 35.5,27.5 43.08,35.08 50.48,35.08 56.07,40.68 56.07,50.05 v1(57.22,51.2) ; v1(34.04,25.14) 33.53,24.63 33.53,6.85 v1(32.63,5.96)
$1N831: length 5.1
  Top Layer w0.254: R10.2 91.28,34.54 LED5V.A
$1N927: length 19.5
  Top Layer w0.254: v1(62.51,26.77) 64.83,26.77 R13.2
  Bottom Layer w0.254: OLED/TFT1.3 61.53,10.97 61.53,25.79 v1(62.51,26.77)
$1N930: length 44.6
  Top Layer w0.254: v1(68.71,42.92) 69.09,43.3 69.09,44.59 67.72,45.96 65.06,45.96 v1(64.59,45.49) ; OLED/TFT1.4 67.11,13.12 v1(67.11,15.88)
  Bottom Layer w0.254: v1(64.59,45.49) 64.59,46.15 R14.2 ; v1(68.71,42.92) 69.13,42.5 69.13,40.85 69.55,40.42 70.06,40.42 70.87,39.62 70.87,25.34 69.92,25.34 69.13,24.54 69.13,17.91 v1(67.11,15.88)
$1N1033: length 11
  Top Layer w0.254: Q2.3 65.41,34.16 v1(64.77,33.52)
  Bottom Layer w0.254: B1.2 61.78,29.13 64.77,32.12 v1(64.77,33.52)
$1N1034: length 27.4
  Top Layer w0.254: B1.1 61.65,36.13 v1(63.88,33.9)
  Bottom Layer w0.254: v1(63.88,33.9) 63.88,31.92 63.64,31.67 60.26,31.67 58.93,30.34 58.93,15.58 R15.2
$1N1043: length 1.9
  Top Layer w0.254: R16.2 70.75,31.52 Q2.1
$1N1188: length 15.6
  Bottom Layer w0.254: R20.2 57.98,13.56 57.98,8.69 编码器2.6
$1N1189: length 14.9
  Top Layer w0.254: v1(49.79,18.65) R21.1
  Bottom Layer w0.254: 编码器2.2 48.9,17.75 v1(49.79,18.65)
$1N1190: length 40.6
  Top Layer w0.254: v1(69.74,18.34) 68.75,17.34 R18.2
  Bottom Layer w0.254: 编码器2.5 55.31,3.49 63.69,3.49 64.21,2.97 64.21,1.95 64.83,1.33 71.59,1.33 73.28,3.02 73.28,13.03 69.74,16.57 v1(69.74,18.34)
$1N1191: length 29.7
  Top Layer w0.254: v1(50.55,17.39) 53.59,17.39 54.74,18.55 v1(62.33,18.55)
  Bottom Layer w0.254: R19.1 62.33,17.01 v1(62.33,18.55) ; 编码器2.1 49.98,3.23 49.98,16.82 v1(50.55,17.39)
$1N1401: length 10.4
  Top Layer w1: 3.67,23.79 1.81,25.65 1.81,29.46
  Bottom Layer w1: 3.67,23.79 3.48,23.98 3.48,27.64
$1N1404: length 18.5
  Top Layer w0.254: D1.K 8.28,42.08 ON/OFF1.1
  Bottom Layer w1: ON/OFF1.1 1.78,35.58 1.78,27.64
$1N1405: length 15.4
  Top Layer w0.254: 4.44,45.46 ON/OFF1.3 ; 4.44,45.46 R2.2 ; 4.44,45.46 5.25,44.65 10.56,44.65 D1.A
$1N1408: length 10.1
  Top Layer w1: ON/OFF1.2 1.81,40.41 1.81,34.02
$1N1512: length 53
  Top Layer w0.254: v1(68.14,15.53) 71.23,12.44 P5.3
  Bottom Layer w0.254: 59.27,46.09 59.01,45.84 59.01,42.79 65.53,42.79 66.18,42.14 66.18,15.6 66.55,15.23 67.84,15.23 v1(68.14,15.53)
$1N1513: length 4.3
  Top Layer w0.254: P6.3 87.88,18.15 R36.2
$1N1603: length 5.9
  Top Layer w0.254: v1(87.95,48.98) 87.34,48.98 STEER1.1
  Bottom Layer w0.254: R34.2 85.77,47.41 STEER1.1 ; R33.1 88.43,49.46 v1(87.95,48.98)
$1N1624: length 3.1
  Bottom Layer w0.254: 95.25,41.39 95.08,41.23 R22.2
$1N1625: length 27.3
  Bottom Layer w0.254: 77.98,28.28 81.7,32 91.97,32 97.79,37.81 97.79,41.39
$1N1628: length 8.8
  Top Layer w0.254: v1(96.26,39.01) 97.83,39.01 98.27,39.45 ; v1(90.68,38.09) 90,38.09
  Bottom Layer w0.254: v1(90.68,38.09) 95.35,38.09 v1(96.26,39.01)
$1N1629: length 13
  Top Layer w0.254: S2.2 97.03,36.11 v1(97.03,38.09) ; v1(90.65,33.01) R25.2
  Bottom Layer w0.254: v1(90.65,33.01) 91.95,33.01 v1(97.03,38.09)
$1N1630: length 10.8
  Top Layer w0.254: R26.2 88.61,28.57 97.17,28.57 S3.2
$1N1631: length 11.5
  Top Layer w0.254: v1(96.62,22.41) 96.62,23.58 S4.2 ; v1(91.94,26.84) 91.62,26.52 R27.2
  Bottom Layer w0.254: v1(91.94,26.84) 92.19,26.84 v1(96.62,22.41)
$1N1632: length 39.8
  Top Layer w0.254: v1(78.49,36.19) 76.41,36.19 75.78,36.82 R28.2 ; RST1.2 96.3,20.45 v1(96.3,21.68)
  Bottom Layer w0.254: v1(96.3,21.68) 95.99,22 95.99,22.33 95.33,22.98 91.81,22.98 91.52,22.7 87.15,22.7 86.66,23.19 86.66,24.48 83.78,27.36 77.54,27.36 77.21,27.68 77.21,29.2 78.21,30.19 78.21,35.91 v1(78.49,36.19)
$1N8370: length 5
  Bottom Layer w1: P9.1 P10.1
$1N8373: length 5
  Bottom Layer w1: P9.2 P10.2
$1N8376: length 5
  Bottom Layer w1: P9.3 P10.3
$1N8379: length 5
  Bottom Layer w1: P9.4 P10.4
$1N8382: length 5
  Bottom Layer w1: P9.5 P10.5
$1N8385: length 5
  Bottom Layer w1: P9.6 P10.6
$1N8391: length 5
  Bottom Layer w1: P8.1 P11.1
$1N8394: length 5
  Bottom Layer w1: P8.2 P11.2
$1N8397: length 5
  Bottom Layer w1: P8.3 P11.3
$1N8400: length 5
  Bottom Layer w1: P8.4 P11.4
$1N8403: length 5
  Bottom Layer w1: P8.5 P11.5
$1N8406: length 5
  Bottom Layer w1: P8.6 P11.6

## Text on the board
Top Layer: P62 | P66 | P60 | P64 | 安徽科技学院 / 磁力狂飙 / 2024.4.23
Top Silkscreen Layer: 安徽科技学院 / 磁力狂飙 / 2024.4.23
